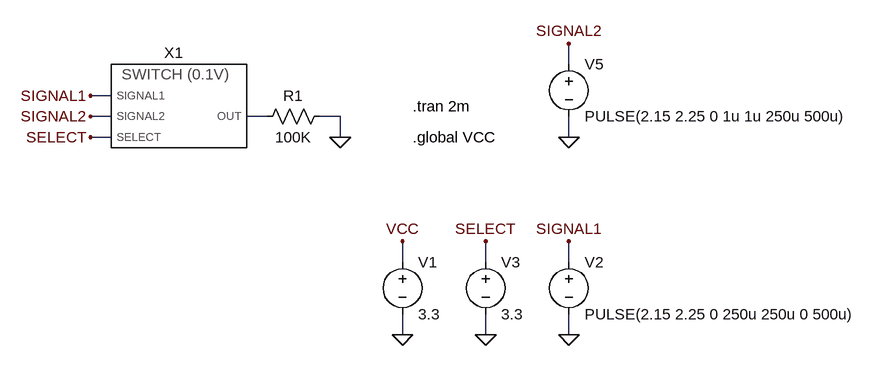
[diagram p0: schematic test_switch2_0.1v.asc]
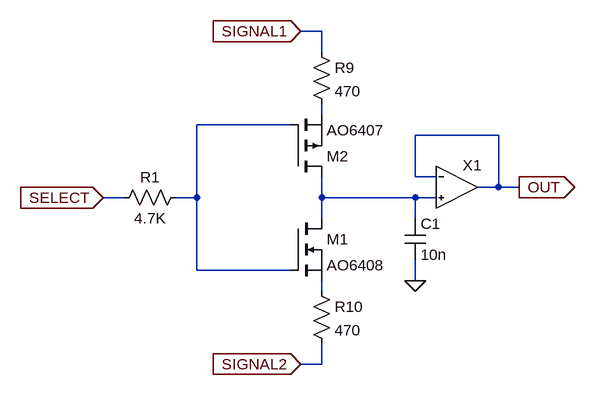
[diagram p1: sub-circuit switch2_0.1v.asc]
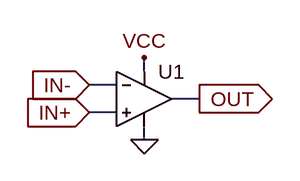
[diagram p2: sub-circuit opamp.asc]
test_switch2_0.1v.asc, the LTspice schematic file:
Version 4
SHEET 1 1908 768
WIRE 1024 240 1024 208
WIRE 320 288 288 288
WIRE 320 320 288 320
WIRE 560 320 528 320
WIRE 672 320 640 320
WIRE 320 352 288 352
WIRE 672 352 672 320
WIRE 1024 352 1024 320
WIRE 768 544 768 512
WIRE 896 544 896 512
WIRE 1024 544 1024 512
WIRE 768 656 768 624
WIRE 896 656 896 624
WIRE 1024 656 1024 624
FLAG 672 352 0
FLAG 768 656 0
FLAG 768 512 VCC
FLAG 1024 656 0
FLAG 1024 512 SIGNAL1
FLAG 288 288 SIGNAL1
FLAG 288 320 SIGNAL2
FLAG 896 656 0
FLAG 896 512 SELECT
FLAG 288 352 SELECT
FLAG 1024 352 0
FLAG 1024 208 SIGNAL2
SYMBOL res 656 304 R90
WINDOW 0 0 56 VBottom 2
WINDOW 3 32 56 VTop 2
SYMATTR InstName R1
SYMATTR Value 100K
SYMBOL voltage 768 528 R0
WINDOW 123 0 0 Left 0
WINDOW 39 0 0 Left 0
SYMATTR InstName V1
SYMATTR Value 3.3
SYMBOL voltage 1024 528 R0
WINDOW 123 0 0 Left 0
WINDOW 39 0 0 Left 0
SYMATTR InstName V2
SYMATTR Value PULSE(2.15 2.25 0 250u 250u 0 500u)
SYMBOL voltage 896 528 R0
WINDOW 123 0 0 Left 0
WINDOW 39 0 0 Left 0
SYMATTR InstName V3
SYMATTR Value 3.3
SYMBOL voltage 1024 224 R0
WINDOW 123 0 0 Left 0
WINDOW 39 0 0 Left 0
SYMATTR InstName V5
SYMATTR Value PULSE(2.15 2.25 0 1u 1u 250u 500u)
SYMBOL switch2_0.1v 352 288 R0
SYMATTR InstName X1
TEXT 784 304 Left 2 !.tran 2m
TEXT 784 352 Left 2 !.global VCC

switch2_0.1v.asc, the sub-circuit schematic file:
Version 4
SHEET 1 1676 680
WIRE 592 -64 560 -64
WIRE 592 -32 592 -64
WIRE 592 64 592 48
WIRE 544 80 400 80
WIRE 864 96 736 96
WIRE 736 160 736 96
WIRE 768 160 736 160
WIRE 864 176 864 96
WIRE 864 176 832 176
WIRE 896 176 864 176
WIRE 288 192 256 192
WIRE 400 192 400 80
WIRE 400 192 368 192
WIRE 592 192 592 160
WIRE 736 192 592 192
WIRE 768 192 736 192
WIRE 592 224 592 192
WIRE 736 224 736 192
WIRE 400 304 400 192
WIRE 544 304 400 304
WIRE 736 320 736 288
WIRE 592 336 592 320
WIRE 592 448 592 416
WIRE 592 448 560 448
FLAG 560 -64 SIGNAL1
IOPIN 560 -64 In
FLAG 560 448 SIGNAL2
IOPIN 560 448 In
FLAG 256 192 SELECT
IOPIN 256 192 In
FLAG 896 176 OUT
IOPIN 896 176 Out
FLAG 736 320 0
SYMBOL nmos 544 224 R0
SYMATTR InstName M1
SYMATTR Value AO6408
SYMBOL pmos 544 160 M180
SYMATTR InstName M2
SYMATTR Value AO6407
SYMBOL cap 720 288 M180
WINDOW 0 24 56 Left 2
WINDOW 3 24 8 Left 2
SYMATTR InstName C1
SYMATTR Value 10n
SYMBOL res 576 -48 R0
SYMATTR InstName R9
SYMATTR Value 470
SYMBOL res 576 320 R0
SYMATTR InstName R10
SYMATTR Value 470
SYMBOL opamp 800 176 R0
WINDOW 0 9 -34 Left 2
SYMATTR InstName X1
SYMBOL res 384 176 R90
WINDOW 0 0 56 VBottom 2
WINDOW 3 32 56 VTop 2
SYMATTR InstName R1
SYMATTR Value 4.7K

opamp.asc, the sub-circuit schematic file:
Version 4
SHEET 1 880 680
WIRE 144 144 144 128
WIRE 112 160 80 160
WIRE 208 176 176 176
WIRE 112 192 80 192
WIRE 144 224 144 208
FLAG 144 224 0
FLAG 144 128 VCC
FLAG 208 176 OUT
IOPIN 208 176 Out
FLAG 80 192 IN+
IOPIN 80 192 In
FLAG 80 160 IN-
IOPIN 80 160 In
SYMBOL Opamps\\UniversalOpamp2 144 176 R0
SYMATTR InstName U1
SYMATTR Value2 Avol=1Meg GBW=1.2Meg Slew=10Meg

The netlist it stands for:
* test_switch2_0.1v.asc
R1 0 N001 100K
V1 VCC 0 3.3
V2 SIGNAL1 0 PULSE(2.15 2.25 0 250u 250u 0 500u)
V3 SELECT 0 3.3
V5 SIGNAL2 0 PULSE(2.15 2.25 0 1u 1u 250u 500u)
XX1 SELECT SIGNAL1 SIGNAL2 N001 switch2_0.1v

* block symbol definitions
.subckt switch2_0.1v SELECT SIGNAL1 SIGNAL2 OUT
M1 N003 N002 N004 N004 AO6408
M2 N003 N002 N001 N001 AO6407
C1 0 N003 10n
R9 SIGNAL1 N001 470
R10 N004 SIGNAL2 470
XX1 N003 OUT OUT opamp
R1 N002 SELECT 4.7K
.ends switch2_0.1v

.subckt opamp IN+ IN- OUT
XU1 IN+ IN- VCC 0 OUT level.2 Avol=1Meg GBW=1.2Meg Slew=10Meg ilimit=25m rail=0 Vos=0 phimargin=45 en=0 enk=0 in=0 ink=0 Rin=500Meg  ; pins IN+ IN- V+ V- OUT
.ends opamp

.model NMOS NMOS
.model PMOS PMOS
.lib standard.mos
.tran 2m
.global VCC
.lib UniversalOpamps2.sub
.backanno
.end